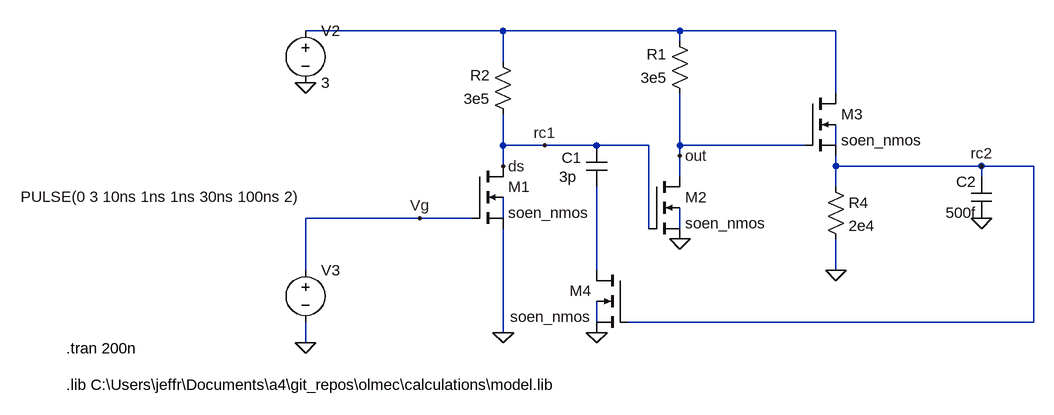
[diagram p0: schematic mosfet__inverters.asc]
mosfet__inverters.asc, the LTspice schematic file:
Version 4
SHEET 1 880 680
WIRE -272 16 -576 16
WIRE 0 16 -272 16
WIRE 240 16 0 16
WIRE 0 32 0 16
WIRE -272 64 -272 16
WIRE 240 112 240 16
WIRE -272 192 -272 144
WIRE -208 192 -272 192
WIRE -128 192 -208 192
WIRE -48 192 -128 192
WIRE 0 192 0 112
WIRE 192 192 0 192
WIRE 240 192 240 160
WIRE 0 208 0 192
WIRE -272 224 -272 192
WIRE 240 224 240 208
WIRE 464 224 240 224
WIRE 544 224 464 224
WIRE 0 240 0 208
WIRE 464 240 464 224
WIRE 240 256 240 224
WIRE -400 304 -576 304
WIRE -320 304 -400 304
WIRE -272 304 -272 272
WIRE -48 320 -48 192
WIRE 0 320 0 288
WIRE -576 384 -576 304
WIRE -128 384 -128 256
WIRE 240 384 240 336
WIRE -128 464 -128 432
WIRE 544 464 544 224
WIRE 544 464 -80 464
WIRE -272 480 -272 320
WIRE -576 496 -576 464
FLAG -576 96 0
FLAG -576 496 0
FLAG -272 224 ds
FLAG -400 304 Vg
FLAG -272 480 0
FLAG -208 192 rc1
FLAG 0 208 out
FLAG 0 336 0
FLAG -128 480 0
FLAG 240 384 0
FLAG 464 304 0
FLAG 464 224 rc2
SYMBOL voltage -576 0 R0
WINDOW 123 0 0 Left 0
WINDOW 39 0 0 Left 0
SYMATTR InstName V2
SYMATTR Value 3
SYMBOL voltage -576 368 R0
WINDOW 123 0 0 Left 0
WINDOW 39 0 0 Left 0
WINDOW 3 -438 -97 Left 2
SYMATTR Value PULSE(0 3 10ns 1ns 1ns 30ns 100ns 2)
SYMATTR InstName V3
SYMBOL nmos4 -320 224 R0
SYMATTR InstName M1
SYMATTR Value soen_nmos
SYMATTR Value2 l=1u w=10u
SYMBOL cap -144 192 R0
WINDOW 0 -38 19 Left 2
WINDOW 3 -42 48 Left 2
SYMATTR InstName C1
SYMATTR Value 3p
SYMBOL res -256 160 R180
WINDOW 0 36 76 Left 2
WINDOW 3 36 40 Left 2
SYMATTR InstName R2
SYMATTR Value 3e5
SYMBOL nmos4 -48 240 R0
SYMATTR InstName M2
SYMATTR Value soen_nmos
SYMATTR Value2 l=1u w=10u
SYMBOL res 16 128 R180
WINDOW 0 36 76 Left 2
WINDOW 3 36 40 Left 2
SYMATTR InstName R1
SYMATTR Value 3e5
SYMBOL nmos4 192 112 R0
SYMATTR InstName M3
SYMATTR Value soen_nmos
SYMATTR Value2 l=1u w=15u
SYMBOL res 224 240 R0
SYMATTR InstName R4
SYMATTR Value 2e4
SYMBOL cap 480 304 R180
WINDOW 0 24 56 Left 2
WINDOW 3 24 8 Left 2
SYMATTR InstName C2
SYMATTR Value 500f
SYMBOL nmos4 -80 384 M0
SYMATTR InstName M4
SYMATTR Value soen_nmos
SYMATTR Value2 l=1u w=15u
TEXT -944 504 Left 2 !.tran 200n
TEXT -944 560 Left 2 !.lib C:\\Users\\jeffr\\Documents\\a4\\git_repos\\olmec\\calculations\\model.lib

The netlist it stands for:
* mosfet__inverters.asc
V2 N001 0 3
V3 Vg 0 PULSE(0 3 10ns 1ns 1ns 30ns 100ns 2)
M1 rc1 Vg 0 N003 soen_nmos l=1u w=10u
C1 rc1 N005 3p
R2 rc1 N001 3e5
M2 out rc1 0 N004 soen_nmos l=1u w=10u
R1 out N001 3e5
M3 N001 out rc2 N002 soen_nmos l=1u w=15u
R4 rc2 0 2e4
C2 0 rc2 500f
M4 N005 rc2 0 N006 soen_nmos l=1u w=15u
.model NMOS NMOS
.model PMOS PMOS
.lib standard.mos
.tran 200n
.lib C:\Users\jeffr\Documents\a4\git_repos\olmec\calculations\model.lib
.backanno
.end